# EAGLE design IFA_v1 (EAGLE 7.1.0)
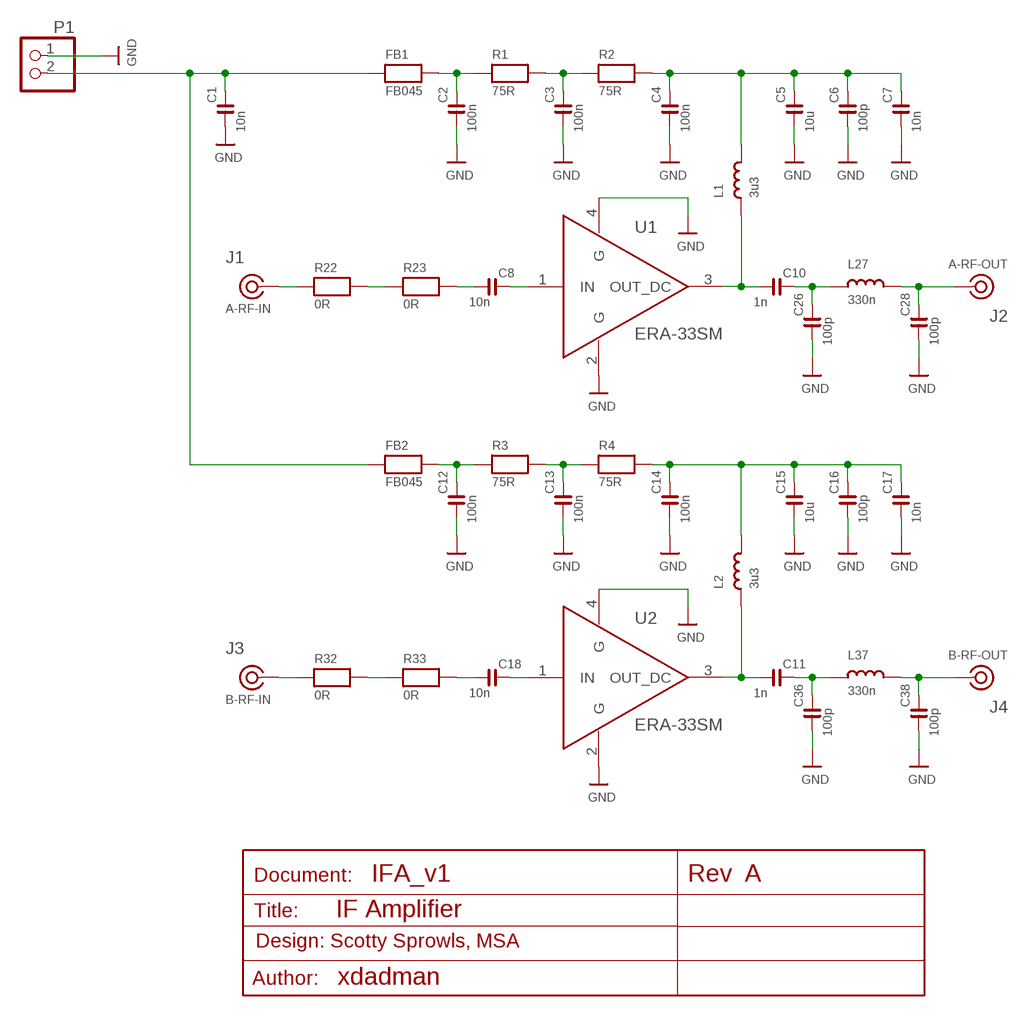
[diagram p0: schematic, sheet 1]

## Parts
C1  10n  C080510N  [C0805]
C2  100n  C0805100N  [C0805]
C3  100n  C0805100N  [C0805]
C4  100n  C0805100N  [C0805]
C5  10u  CC120610U  [C1206]
C6  100p  C0805100P  [C0805]
C7  10n  C080510N  [C0805]
C8  10n  C080510N  [C0805]
C10  1n  C08051N  [C0805]
C11  1n  C08051N  [C0805]
C12  100n  C0805100N  [C0805]
C13  100n  C0805100N  [C0805]
C14  100n  C0805100N  [C0805]
C15  10u  CC120610U  [C1206]
C16  100p  C0805100P  [C0805]
C17  10n  C080510N  [C0805]
C18  10n  C080510N  [C0805]
C26  100p  C0805100P  [C0805]
C28  100p  C0805100P  [C0805]
C36  100p  C0805100P  [C0805]
C38  100p  C0805100P  [C0805]
FB1  FB045  R0805FB045  [R0805]
FB2  FB045  R0805FB045  [R0805]
J1  A-RF-IN  COAX  [SLIM_COAX_PAD]
J2  A-RF-OUT  COAX  [SLIM_COAX_PAD]
J3  B-RF-IN  COAX  [SLIM_COAX_PAD]
J4  B-RF-OUT  COAX  [SLIM_COAX_PAD]
L1  3u3  L08053U3  [L805]
L2  3u3  L08053U3  [L805]
L27  330n  L0805330N  [L805]
L37  330n  L0805330N  [L805]
P1  PINHD-1X2  [1X02]
R1  75R  R080575R  [R0805]
R2  75R  R080575R  [R0805]
R3  75R  R080575R  [R0805]
R4  75R  R080575R  [R0805]
R22  0R  R08050R  [R0805]
R23  0R  R08050R  [R0805]
R32  0R  R08050R  [R0805]
R33  0R  R08050R  [R0805]
U1  ERA-33SM  [WW107]
U2  ERA-33SM  [WW107]

## Nets
GND: C1.1 C2.1 C3.1 C4.1 C5.1 C6.1 C7.1 C12.1 C13.1 C14.1 C15.1 C16.1 C17.1 C26.1 C28.1 C36.1 C38.1 P1.1 U1.2(G) U1.4(G) U2.2(G) U2.4(G)
N$1: C2.2 FB1.2 R1.1
N$2: C1.2 FB1.1 FB2.1 P1.2
N$3: C3.2 R1.2 R2.1
N$4: J1.SIG R22.1
N$5: C4.2 C5.2 C6.2 C7.2 L1.2 R2.2
N$6: R22.2 R23.1
N$7: C8.1 R23.2
N$8: C8.2 U1.1(IN)
N$9: C28.2 J2.SIG L27.2
N$11: C10.1 L1.1 U1.3(OUT_DC)
N$12: C10.2 C26.2 L27.1
N$13: C12.2 FB2.2 R3.1
N$14: C13.2 R3.2 R4.1
N$15: C14.2 C15.2 C16.2 C17.2 L2.2 R4.2
N$16: J3.SIG R32.1
N$17: R32.2 R33.1
N$18: C18.1 R33.2
N$19: C18.2 U2.1(IN)
N$20: C11.1 L2.1 U2.3(OUT_DC)
N$21: C11.2 C36.2 L37.1
N$22: C38.2 J4.SIG L37.2

## Notes on the sheet
- A
- IF Amplifier
- Design: Scotty Sprowls, MSA
- xdadman

## Power pins joined to a net without a drawn wire
GND: J1.GND J2.GND J3.GND J4.GND

## Library data of the parts
C1 C7 C8 C17 C18 = MSA_lib:C0805: Ceramic capacitor; OC_FARNELL: 1414662
C2-C4 C12-C14 = MSA_lib:C0805: Ceramic capacitor; OC_FARNELL: 1759166
C5 C15 = MSA_lib:CC1206: Capacitor ceramic 1206; OC_FARNELL: 1611967
C6 C16 C26 C28 C36 C38 = MSA_lib:C0805: Ceramic capacitor; OC_FARNELL: 1414656
C10 C11 = MSA_lib:C0805: Ceramic capacitor; OC_FARNELL: 1833879
FB1 FB2 = MSA_lib:R0805: Resistors; OC_FARNELL: 1515661
J1-J4 = MSA_lib:COAX
L1 L2 = MSA_lib:L0805: 0805 Inductor; OC_FARNELL: 1669549
L27 L37 = MSA_lib:L0805: 0805 Inductor; OC_FARNELL: 9527923
P1 = MSA_lib:PINHD-1X2: PIN HEADER
R1-R4 = MSA_lib:R0805: Resistors; OC_FARNELL: 2332056
R22 R23 R32 R33 = MSA_lib:R0805: Resistors; OC_FARNELL: 2057661
U1 U2 = MSA_lib:ERA-33SM: Monolithic Amplifier 3Ghz; VENDOR: minicirquits

## Board

Size 32 x 32 mm. Coordinates in mm from the lower left corner, seen from the top.
Outline: 0,0 32,0 32,32 0,32 0,0
Copper layers (1*16): Top 0.035mm / dielectric 1.5mm / Bottom 0.035mm
Design rules "kuba_no_CLR": minimum track width 8mil, minimum drill 15mil, track to track 8mil, track to pad 8mil, pad to pad 8mil, via to via 8mil, smd to smd 8mil, copper to edge 0mil, drill to drill 8mil, minimum pad ring 12mil, minimum via ring 10mil, stop-mask expansion 4mil, vias tented up to drill 0mil, thermal gap 10mil

### Footprints (pad centres in the part's own frame; a part is rotated, then mirrored left to right if it is on the bottom)
C0805 = smd 1.2 x 1.5: 1 -0.953,0; 2 0.953,0
C1206 = smd 1.6 x 1.8: 1 -1.4,0; 2 1.4,0
R0805 = smd 1.3 x 1.5: 1 -0.95,0; 2 0.95,0
SLIM_COAX_PAD = smd 1.27 x 0.635 bottom: GND 0,-2.667 | drill 1.1: SIG 0,0
L805 = smd 1.3 x 1.5: 1 -0.95,0; 2 0.95,0
1X02 = drill 1.016: 1 -1.27,0; 2 1.27,0
WW107 = smd 1.02 x 1.83: 1 0,-2.1; 3 0,2.1 | smd 1.83 x 1.02: 2 2.1,0; 4 -2.1,0

### Placement (x,y rotation side)
C1  9.27,15.88 180 top
C2  3.94,13.59 0 top
C3  11.94,14.1 270 top
C4  18.67,11.68 180 top
C5  18.03,13.59 180 top
C6  18.67,8.13 180 top
C7  18.67,9.91 180 top
C8  26.67,6.35 180 top
C10  13.08,6.35 180 top
C11  12.95,25.15 180 top
C12  3.81,18.29 0 top
C13  11.94,17.78 90 top
C14  18.29,20.07 180 top
C15  17.65,18.03 180 top
C16  18.29,23.62 180 top
C17  18.29,21.84 180 top
C18  26.92,25.91 180 top
C26  12.45,3.56 90 top
C28  6.86,3.56 90 top
C36  12.95,27.94 270 top
C38  7.24,27.94 270 top
FB1  7.75,13.59 180 top
FB2  7.49,18.29 180 top
J1  24.64,9.78 90 top
J2  6.86,7.75 270 top
J3  24.64,22.23 90 top
J4  6.99,24.26 270 top
L1  15.88,7.37 90 top
L2  15.62,24.64 270 top
L27  9.65,4.45 180 top
L37  10.03,27.05 180 top
P1  4.7,16 0 top
R1  7.24,11.3 0 top
R2  12.95,11.3 0 top
R3  7.24,20.45 0 top
R4  12.95,20.57 0 top
R22  26.67,11.94 0 top
R23  27.69,9.14 270 top
R32  27.05,20.32 0 top
R33  27.94,23.11 90 top
U1  20.7,6.22 90 top
U2  20.7,25.78 90 top

### Tracks (layer width: path | path; a pad name or v marks a point on that pad's centre or on a via)
GND  (via drill 0.5)  (1 unrouted)
  Top 1.016: C1.1 11.94,15.88 12.06,16 12.06,16.7 C13.1 | P1.1 1.78,16 v1.65,15.88 2.98,14.54 C2.1 | 2.54,14.22 2.79,14.22 2.79,17.78
  other vias: 1.78,30.23 6.99,30.1 12.95,30.1 18.41,30.1 22.61,30.1 19.3,27.81 19.3,29.08 20.7,29.08 22.1,29.08 22.1,27.81 26.67,30.23 30.1,30.1 30.23,26.29 30.23,20.95 30.23,16 27.18,16 23.75,15.88 20.07,16 16.38,16 13.08,16 20.32,12.45 19.56,8.13 20.57,9.65 19.56,23.88 20.7,22.35 20.57,19.81 30.23,11.81 30.23,7.75 30.23,1.91 26.67,1.65 22.48,1.65 18.54,1.65 19.43,4.45 19.43,3.05 20.7,2.92 22.1,3.05 21.84,4.45 12.32,1.65 6.73,1.65 1.78,1.65 1.65,6.99 1.65,11.43 1.65,20.95 1.78,25.53
  pour Top (no thermals): 0,0 32,0 32,32 0,32 0,2.29 2.29,2.29 2.29,29.46 29.46,29.46 29.46,2.03 0,2.03
  pour Top (no thermals): 11.94,16.64 11.94,15.24 29.72,15.24 29.72,16.64
  pour Top (no thermals): 19.18,7.49 21.21,7.62 21.21,24.51 18.67,24.51 18.67,24.38 18.92,24.38 19.18,7.75
  pour Top (no thermals): 17.65,5.21 23.62,5.21 23.62,1.78 17.65,1.78 17.65,5.08
  pour Top (no thermals): 17.65,27.05 23.62,27.05 23.62,29.59 17.65,29.59
  pour Bottom: 0,0 32,0 32,32 0,32
  pour Top: 0,2.79 0,1.27 2.29,1.27 2.29,2.79
N$1
  Top 1.016: C2.2 6.22,13.59 | 6.22,13.59 FB1.2 | R1.1 6.29,13.52 6.22,13.59
N$2
  Top 1.016: FB1.1 8.7,14.67 8.26,15.11 8.26,15.81 C1.2 | FB2.1 8.44,16.7 8.38,16.64 8.38,15.94 C1.2 | P1.2 8.19,16 C1.2
N$3
  Top 1.016: C3.2 11.94,11.37 R2.1 R1.2
N$4
  Top 1.016: J1.SIG 24.64,10.16 25.65,11.18 25.65,11.87 R22.1
N$5  (1 unrouted)
  Top 1.016: L1.2 16.76,8.32 | 16.76,8.32 17.53,8.32 C6.2 C7.2 17.72,11.3 | 17.72,11.3 C4.2 | R2.2 17.72,11.3 | C5.2 16.63,8.45 16.76,8.32 | 17.02,12.19 17.02,8.38
N$6
  Top 1.016: R23.1 27.69,11.87 R22.2
N$7
  Top 1.016: C8.1 27.62,8.13 R23.2
N$8
  Top 1.016: U1.1 25.59,6.22 C8.2
N$9
  Top 1.016: J2.SIG C28.2 8.64,4.51 L27.2
N$11
  Top 1.016: C10.1 15.81,6.35 L1.1 16.07,6.22 U1.3
N$12
  Top 1.016: L27.1 12.38,4.45 C26.2 12.13,4.83 C10.2
N$13
  Top 1.016: C12.2 FB2.2 6.29,18.54 R3.1
N$14
  Top 1.016: C13.2 11.94,20.51 R4.1 8.32,20.57 R3.2
N$15
  Top 1.016: R4.2 16.89,20.57 17.27,20.95 17.27,20.13 C14.2 17.34,21.08 C17.2 C16.2 17.34,23.18 16.76,22.61 16.25,22.61 | C15.2 16.25,22.61 | 16.25,22.61 16.25,23.62 16.38,23.75 15.68,23.75 L2.2
N$16
  Top 1.016: J3.SIG 24.64,21.78 R32.1
N$17
  Top 1.016: R33.1 27.94,20.38 R32.2
N$18
  Top 1.016: C18.1 27.88,24.13 R33.2
N$19
  Top 1.016: U2.1 25.84,25.78 C18.2
N$20
  Top 1.016: U2.3 15.81,25.78 L2.1 14.35,25.59 C11.1
N$21
  Top 1.016: L37.1 12.06,27.05 | 12.06,27.05 12.89,27.05 C36.2 | C11.2 12,26.99 12.06,27.05
N$22
  Top 1.016: L37.2 7.3,27.05 C38.2 7.24,24.51 J4.SIG

### Text on the board
tPlace: C36 | L2 | U2 | C38 | L37 | C18 | C11 | C16 | R33 | J4-B-RF-O | R4 | C17 | R3 | C14 | C12 | R32 | FB2 | C13 | C15 | J3-B-RF-I | J1-A-RF-I | C1 | C5 | C2 | C3 | R1 | C4 | R22 | J2-A-RF-O | R2 | C7 | U1 | C6 | FB1 | C10 | R23 | L27 | L1 | C8 | C28 | IF Amp | C26